# Altium project Spektrum Adapter SMD.PrjPCB
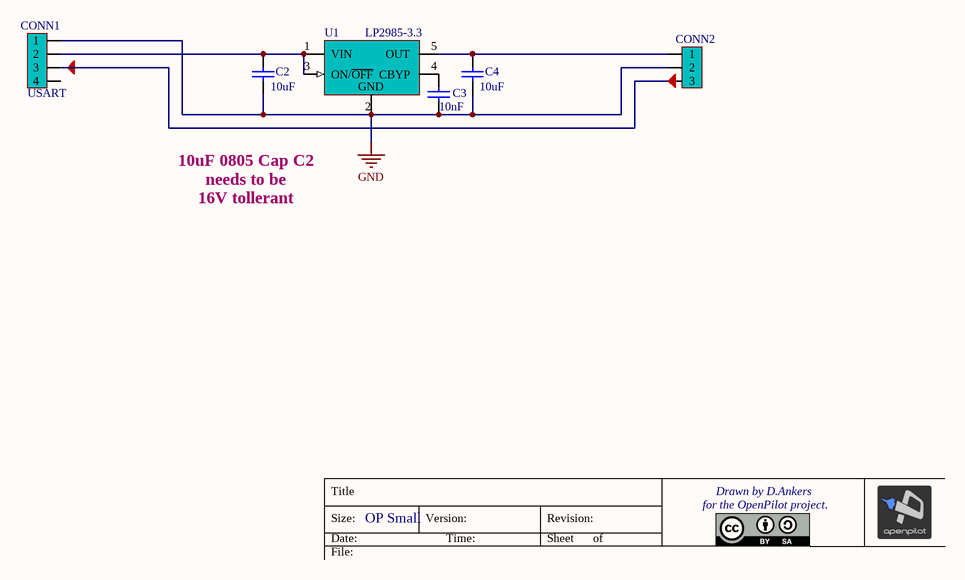
[diagram p0: Spektrum Adapter SMD.SchDoc]
1 sheet, 6 parts. Net scope: global (net labels, ports and power ports of the same name join across sheets).
Board file: Spektrum Adapter SMD.PcbDoc

## Sheet Spektrum Adapter SMD.SchDoc: OpenPilot Spektrum Adapter SMD
size 228 x 165 mm; DrawnBy: D. Ankers; Engineer: D. Ankers; Organization: The OpenPilot Project; DocumentNumber: 1; Revision: A; SheetNumber: 1; SheetTotal: 1; License: Creative Commons BY-SA; DocumentName: OpenPilot Spektrum Adapter SMD; ProjectName: OpenPilot

### Parts
C2  value 10uF  [CAP805L]  (hidden comment: Cap805)
C3  value 10nF  [CAP603L]  (hidden comment: Cap603)
C4  value 10uF  [CAP805L]  (hidden comment: Cap805)
CONN1  USART  [JST SH 4 Pin Side Entry]
CONN2  JST ZH 3 Pin  [JST ZH SMD 3 PIN SIDE ENTRY]  (value not drawn)
U1  LP2985-3.3  [SOT23-5L]

### Nets
GND: C2.2 C3.2 C4.2 CONN1.1 CONN2.2 U1.2(GND)
NetC2_1: C2.1 CONN1.2 U1.1(VIN) U1.3(ON/~{OFF})
NetC3_1: C3.1 U1.4(CBYP)
NetC4_1: C4.1 CONN2.1 U1.5(OUT)
NetCONN1_3: CONN1.3 CONN2.3

Not connected (* = marked no-connect by the designer): CONN1 4

### Notes on the sheet
- 10uF 0805 Cap C2
  needs to be
  16V tollerant
- Title
- Size:
- Date:
- OP Small
- Version:
- Time:
- Revision:
- Sheet
- of
- for the OpenPilot project.
- Drawn by D.Ankers
- File:

### Library data of the parts
C2 C4 = Cap805: Capacitor SMD; Published: 1-Nov-2010; LatestRevisionDate: 1-Nov-2010; LatestRevisionNote: Released OpenPilot Lib; PackageReference: 0805 (2012 Metric); Publisher: The OpenPilot Project; Supplier 1: Digi-Key; Supplier Part Number 1: 490-3886-1-ND
C3 = Cap603: Capacitor SMD; Published: 1-Nov-2010; LatestRevisionDate: 1-Nov-2010; LatestRevisionNote: Released OpenPilot Lib; PackageReference: 0603 (1608 Metric); Publisher: The OpenPilot Project; Supplier 1: Digi-Key; Supplier Part Number 1: 399-1091-1-ND
CONN1 = JST-SH 4-pin Side Entry Socket: Manufacturer: Generic Components; Class: Connector; Supplier 1: Digi-Key; Supplier Part Number 1: 455-1804-1-ND
CONN2 = JST ZH 3-pin Side Entry Socket: JST ZH 1.5mm 3-pin Side Entry Socket; Manufacturer: Generic Components; Class: Connector; ComponentLink2Description: Datasheet; LatestRevisionDate: 1-Nov-2010; LatestRevisionNote: Released OpenPilot Lib; Published: 1-Nov-2010; Publisher: The OpenPilot Project; Supplier 1: Digi-Key; Supplier Part Number 1: 455-1694-1-ND
U1 = LP2985-3.3: 3.3V 150mA LDO Regulator; Supplier 1: Digi-Key; Supplier Part Number 1: 296-18476-1-ND